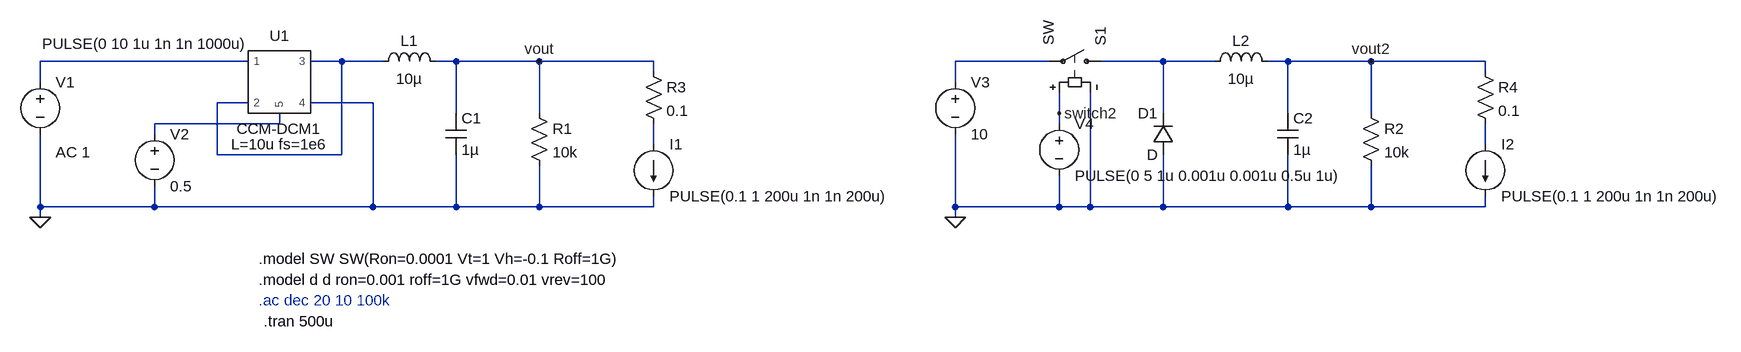
[diagram p0: schematic closed-loop-buck.asc]
closed-loop-buck.asc, the LTspice schematic file:
Version 4
SHEET 1 2288 680
WIRE 0 112 -320 112
WIRE 144 112 96 112
WIRE 208 112 144 112
WIRE 320 112 288 112
WIRE 448 112 320 112
WIRE 624 112 448 112
WIRE 1232 112 1088 112
WIRE 1408 112 1312 112
WIRE 1488 112 1408 112
WIRE 1600 112 1568 112
WIRE 1728 112 1600 112
WIRE 1904 112 1728 112
WIRE 624 128 624 112
WIRE 1904 128 1904 112
WIRE -320 144 -320 112
WIRE 1088 144 1088 112
WIRE 0 176 -48 176
WIRE 192 176 96 176
WIRE 320 192 320 112
WIRE 448 192 448 112
WIRE 1248 192 1248 160
WIRE 1408 192 1408 112
WIRE 1600 192 1600 112
WIRE 1728 192 1728 112
WIRE 48 208 48 192
WIRE 48 208 -144 208
WIRE 1248 208 1248 192
WIRE -144 224 -144 208
WIRE 624 240 624 208
WIRE 1904 240 1904 208
WIRE -48 256 -48 176
WIRE 144 256 144 112
WIRE 144 256 -48 256
WIRE -320 336 -320 224
WIRE -144 336 -144 304
WIRE -144 336 -320 336
WIRE 192 336 192 176
WIRE 192 336 -144 336
WIRE 320 336 320 256
WIRE 320 336 192 336
WIRE 448 336 448 272
WIRE 448 336 320 336
WIRE 624 336 624 320
WIRE 624 336 448 336
WIRE 1088 336 1088 224
WIRE 1248 336 1248 288
WIRE 1248 336 1088 336
WIRE 1296 336 1296 160
WIRE 1296 336 1248 336
WIRE 1408 336 1408 256
WIRE 1408 336 1296 336
WIRE 1600 336 1600 256
WIRE 1600 336 1408 336
WIRE 1728 336 1728 272
WIRE 1728 336 1600 336
WIRE 1904 336 1904 320
WIRE 1904 336 1728 336
WIRE -320 352 -320 336
WIRE 1088 352 1088 336
FLAG -320 352 0
FLAG 448 112 vout
FLAG 1088 352 0
FLAG 1728 112 vout2
FLAG 1248 192 switch2
SYMBOL voltage -320 128 R0
WINDOW 123 24 124 Left 2
WINDOW 39 0 0 Left 0
WINDOW 3 3 -43 Left 2
SYMATTR Value2 AC 1
SYMATTR InstName V1
SYMATTR Value PULSE(0 10 1u 1n 1n 1000u)
SYMBOL ind 192 128 R270
WINDOW 0 32 56 VTop 2
WINDOW 3 5 56 VBottom 2
SYMATTR InstName L1
SYMATTR Value 10µ
SYMBOL cap 304 192 R0
SYMATTR InstName C1
SYMATTR Value 1µ
SYMBOL res 432 176 R0
SYMATTR InstName R1
SYMATTR Value 10k
SYMBOL AutoGenerated\\CCM-DCM1 48 144 R0
SYMATTR InstName U1
SYMBOL voltage -144 208 R0
WINDOW 123 0 0 Left 0
WINDOW 39 0 0 Left 0
SYMATTR InstName V2
SYMATTR Value 0.5
SYMBOL voltage 1088 128 R0
WINDOW 123 0 0 Left 0
WINDOW 39 0 0 Left 0
SYMATTR InstName V3
SYMATTR Value 10
SYMBOL voltage 1248 192 R0
WINDOW 123 0 0 Left 0
WINDOW 39 0 0 Left 0
SYMATTR InstName V4
SYMATTR Value PULSE(0 5 1u 0.001u 0.001u 0.5u 1u)
SYMBOL ind 1472 128 R270
WINDOW 0 32 56 VTop 2
WINDOW 3 5 56 VBottom 2
SYMATTR InstName L2
SYMATTR Value 10µ
SYMBOL sw 1328 112 M270
SYMATTR InstName S1
SYMBOL cap 1584 192 R0
SYMATTR InstName C2
SYMATTR Value 1µ
SYMBOL res 1712 176 R0
SYMATTR InstName R2
SYMATTR Value 10k
SYMBOL diode 1424 256 R180
WINDOW 0 24 64 Left 2
WINDOW 3 24 0 Left 2
SYMATTR InstName D1
SYMBOL current 624 240 R0
WINDOW 123 0 0 Left 0
WINDOW 39 0 0 Left 0
SYMATTR InstName I1
SYMATTR Value PULSE(0.1 1 200u 1n 1n 200u)
SYMBOL res 608 112 R0
SYMATTR InstName R3
SYMATTR Value 0.1
SYMBOL current 1904 240 R0
WINDOW 123 0 0 Left 0
WINDOW 39 0 0 Left 0
SYMATTR InstName I2
SYMATTR Value PULSE(0.1 1 200u 1n 1n 200u)
SYMBOL res 1888 112 R0
SYMATTR InstName R4
SYMATTR Value 0.1
TEXT 16 416 Left 2 !.model SW SW(Ron=0.0001 Vt=1 Vh=-0.1 Roff=1G)
TEXT 16 448 Left 2 !.model d d ron=0.001 roff=1G vfwd=0.01 vrev=100
TEXT 16 480 Left 2 ;.ac dec 20 10 100k
TEXT 24 512 Left 2 !.tran 500u

The netlist it stands for:
* closed-loop-buck.asc
V1 N001 0 PULSE(0 10 1u 1n 1n 1000u) AC 1
L1 N002 vout 10µ
C1 vout 0 1µ
R1 vout 0 10k
XU1 N001 N002 N002 0 N005 CCM-DCM1 L=10u fs=1e6  ; pins 1 2 3 4 5
V2 N005 0 0.5
V3 N003 0 10
V4 switch2 0 PULSE(0 5 1u 0.001u 0.001u 0.5u 1u)
L2 N004 vout2 10µ
S1 N004 N003 switch2 0 SW
C2 vout2 0 1µ
R2 vout2 0 10k
D1 0 N004 D
I1 N006 0 PULSE(0.1 1 200u 1n 1n 200u)
R3 vout N006 0.1
I2 N007 0 PULSE(0.1 1 200u 1n 1n 200u)
R4 vout2 N007 0.1
.model D D
.lib standard.dio
.model SW SW(Ron=0.0001 Vt=1 Vh=-0.1 Roff=1G)
.model d d ron=0.001 roff=1G vfwd=0.01 vrev=100
* .ac dec 20 10 100k
.tran 500u
.lib CCM-DCM1.mod
.backanno
.end